# EAGLE design tiny-avionics (EAGLE 7.7.0)
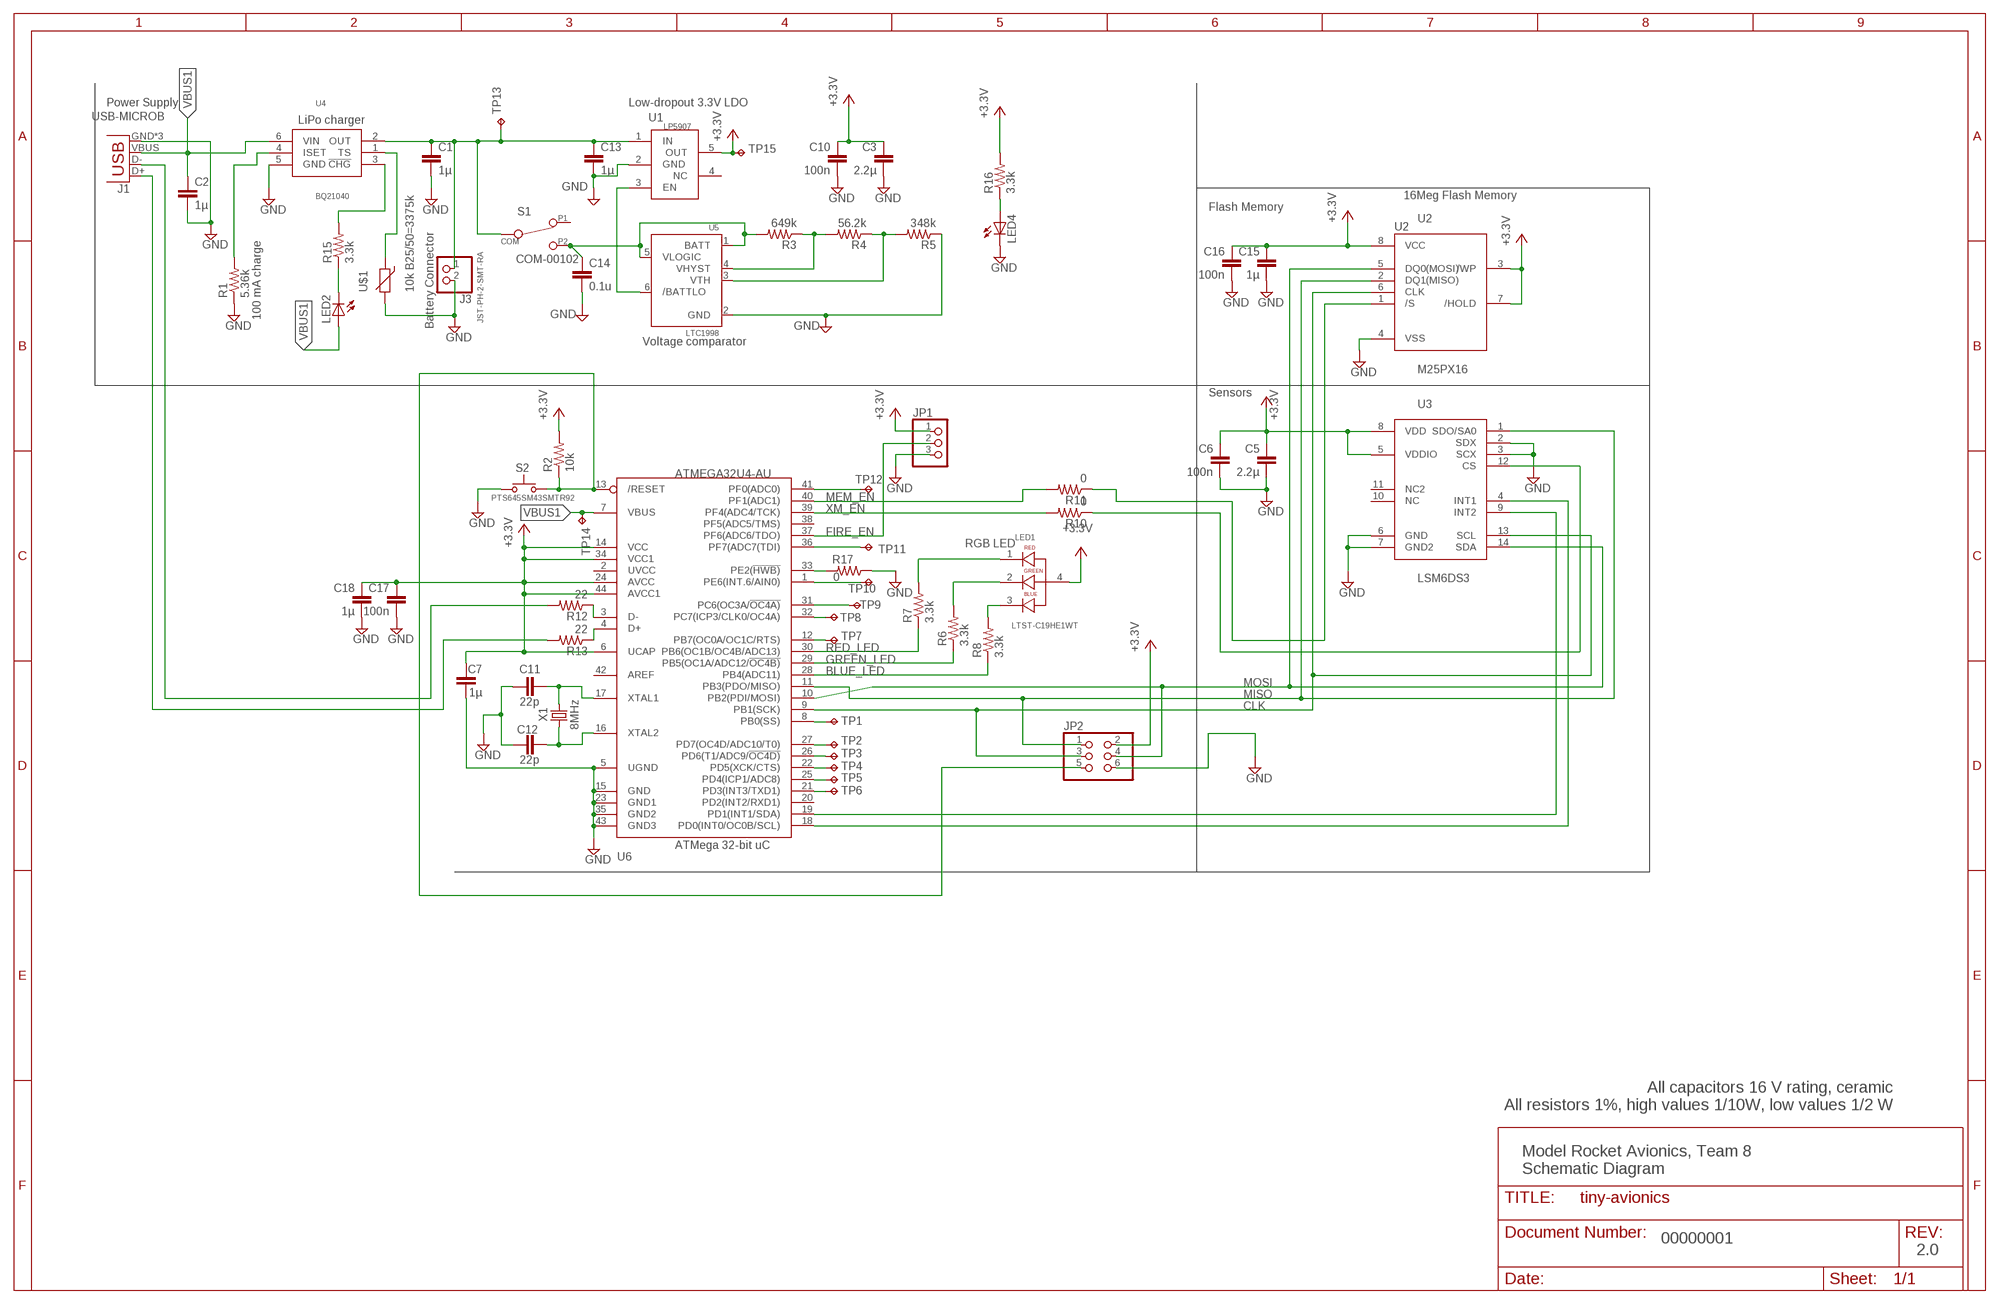
[diagram p0: schematic, sheet 1]

## Parts
C1  1µ  C-EUC0603  [C0603]
C2  1µ  C-EUC0603  [C0603]
C3  2.2µ  C-EUC0603  [C0603]
C5  2.2µ  C-EUC0603  [C0603]
C6  100n  C-EUC0603  [C0603]
C7  1µ  C-EUC0603  [C0603]
C10  100n  C-EUC0603  [C0603]
C11  22p  C-EUC0603  [C0603]
C12  22p  C-EUC0603  [C0603]
C13  1µ  C-EUC0603  [C0603]
C14  0.1u  C-EUC0603  [C0603]
C15  1µ  C-EUC0603  [C0603]
C16  100n  C-EUC0603  [C0603]
C17  100n  C-EUC0603  [C0603]
C18  1µ  C-EUC0603  [C0603]
J1  USB-MICROB  [USB-MICROB]
J3  JST-PH-2-SMT-RA  JST_2PIN-SMT-RA  [JST-PH-2-SMT-RA]
JP1  PINHD-1X3  [1X03]
JP2  PINHD-2X3  [2X03]
LED1  LTST-C19HE1WT  [LEDSC85P160X160X35-4N]
LED2  LEDCHIP-LED0603  [CHIP-LED0603]
LED4  LEDCHIP-LED0603  [CHIP-LED0603]
R1  5.36k  R-US_R0603  [R0603]
R2  10k  R-US_R0603  [R0603]
R3  649k  R-US_R0603  [R0603]
R4  56.2k  R-US_R0603  [R0603]
R5  348k  R-US_R0603  [R0603]
R6  3.3k  R-US_R0603  [R0603]
R7  3.3k  R-US_R0603  [R0603]
R8  3.3k  R-US_R0603  [R0603]
R10  0  R-US_R0603  [R0603]
R11  0  R-US_R0603  [R0603]
R12  22  R-US_R0603  [R0603]
R13  22  R-US_R0603  [R0603]
R15  3.3k  R-US_R0603  [R0603]
R16  3.3k  R-US_R0603  [R0603]
R17  0  R-US_R0603  [R0603]
S1  COM-00102  [ESWITCH]
S2  PTS645SM43SMTR92  PTS645SSMTR  [PTS645-SMD]
TP1  TPTP08R  [TP08R]
TP2  TPTP08R  [TP08R]
TP3  TPTP08R  [TP08R]
TP4  TPTP08R  [TP08R]
TP5  TPTP08R  [TP08R]
TP6  TPTP08R  [TP08R]
TP7  TPTP08R  [TP08R]
TP8  TPTP08R  [TP08R]
TP9  TPTP08R  [TP08R]
TP10  TPTP08R  [TP08R]
TP11  TPTP08R  [TP08R]
TP12  TPTP08R  [TP08R]
TP13  TPTP08R  [TP08R]
TP14  TPTP08R  [TP08R]
TP15  TPTP08R  [TP08R]
U1  LP5907  [SOT23-5L]
U2  M25PX16  [SO8]
U3  LSM6DS3  [LGA-14L]
U4  BQ21040  [SOT23-6L]
U5  LTC1998  [TSOT23-6]
U6  ATMEGA32U4-AU  [TQFP44]
U$1  10k B25/50=3375k  THERMISTOR-SMD0603  [R0603]
X1  8MHz  CRYSTAL-NOGND-SMD  [ATS-SM]

## Nets
BLUE_LED: R8.1 U6.28(PB4(ADC11))
CLK: JP2.3 U2.6(CLK) U3.13(SCL) U6.9(PB1(SCK))
D+: J1.D+ R13.2
D-: J1.D- R12.2
FIRE_EN: JP1.2 U6.37(PF6(ADC6/TDO))
GND: C1.2 C2.2 C3.2 C5.2 C6.2 C7.2 C10.2 C11.2 C12.2 C13.2 C14.2 C15.2 C16.2 C17.2 C18.2 J1.GND J1.MT1(GND) J1.MT2(GND) J3.2 JP1.3 JP2.6 LED4.C R1.1 R5.1 R17.1 S2.1(P) S2.2(P) U1.2(GND) U2.4(VSS) U3.2(SDX) U3.3(SCX) U3.6(GND) U3.7(GND2) U4.5(GND) U5.2(GND) U6.5(UGND) U6.15(GND) U6.23(GND1) U6.35(GND2) U6.43(GND3) U$1.2
GREEN_LED: R6.1 U6.29(PB5(OC1A/ADC12/!OC4B))
MEM_EN: R11.1 U2.1(/S)
MISO: JP2.1 U2.2(DQ1(MISO)) U3.1(SDO/SA0) U6.11(PB3(PDO/MISO))
MOSI: JP2.4 U2.5(DQ0(MOSI)) U3.14(SDA) U6.10(PB2(PDI/MOSI))
N$1: LED1.1 R7.2
N$2: C11.1 U6.17(XTAL1) X1.1
N$3: JP2.5 R2.1 S2.3(S) S2.4(S) U6.13(/RESET)
N$4: R15.2 U4.3(!CHG)
N$5: C12.1 U6.16(XTAL2) X1.2
N$6: R12.1 U6.3(D-)
N$7: LED1.2 R6.2
N$8: LED1.3 R8.2
N$9: U4.1(TS) U$1.1
N$10: U3.4(INT1) U6.18(PD0(INT0/OC0B/SCL))
N$11: U3.9(INT2) U6.19(PD1(INT1/SDA))
N$12: R3.1 R4.2 U5.4(VHYST)
N$13: C1.1 C13.1 J3.1 S1.2(COM) TP13.TP U1.1(IN) U4.2(OUT)
N$14: R4.1 R5.2 U5.3(VTH)
N$15: C14.1 R3.2 S1.3(P2) U5.1(BATT) U5.5(VLOGIC)
N$18: U1.3(EN) U5.6(/BATTLO)
N$21: R10.2 U6.39(PF4(ADC4/TCK))
N$22: R11.2 U6.40(PF1(ADC1))
N$47: R13.1 U6.4(D+)
N$48: LED2.C R15.1
N$49: R1.2 U4.4(ISET)
N$53: LED4.A R16.1
N$65: R17.2 U6.33(PE2(!HWB))
RED_LED: R7.1 U6.30(PB6(OC1B/OC4B/ADC13))
TP1: TP1.TP U6.8(PB0(SS))
TP2: TP2.TP U6.27(PD7(OC4D/ADC10/T0))
TP3: TP3.TP U6.26(PD6(T1/ADC9/!OC4D))
TP4: TP4.TP U6.22(PD5(XCK/CTS))
TP5: TP5.TP U6.25(PD4(ICP1/ADC8))
TP6: TP6.TP U6.21(PD3(INT3/TXD1))
TP7: TP7.TP U6.12(PB7(OC0A/OC1C/RTS))
TP8: TP8.TP U6.32(PC7(ICP3/CLK0/OC4A))
TP9: TP9.TP U6.31(PC6(OC3A/!OC4A))
TP10: TP10.TP U6.1(PE6(INT.6/AIN0))
TP11: TP11.TP U6.36(PF7(ADC7(TDI))
TP12: TP12.TP U6.41(PF0(ADC0))
VBUS1: C2.1 J1.VBUS LED2.A TP14.TP U4.6(VIN) U6.7(VBUS)
VCC: C3.1 C5.1 C6.1 C7.1 C10.1 C15.1 C16.1 C17.1 C18.1 JP1.1 JP2.2 LED1.4 R2.2 R16.2 TP15.TP U1.5(OUT) U2.3(/WP) U2.7(/HOLD) U2.8(VCC) U3.5(VDDIO) U3.8(VDD) U6.6(UCAP) U6.14(VCC) U6.24(AVCC) U6.34(VCC1) U6.44(AVCC1) ; supply symbol labelled +3.3V
XM_EN: R10.1 U3.12(CS)
Unconnected: S1.1 U1.4(NC) U3.10(NC) U3.11(NC2) U6.2(UVCC) U6.20(PD2(INT2/RXD1)) U6.38(PF5(ADC5/TMS)) U6.42(AREF)

## Notes on the sheet
- Power Supply | Low-dropout 3.3V LDO
- LiPo charger | U1
- 16Meg Flash Memory
- Flash Memory
- Battery Connector | U2
- 100 mA charge
- Voltage comparator
- Sensors
- RGB LED
- ATMega 32-bit uC
- All capacitors 16 V rating, ceramic
  All resistors 1%, high values 1/10W, low values 1/2 W
- Model Rocket Avionics, Team 8
  Schematic Diagram
- 00000001
- 2.0

## Library data of the parts
C1-C3 C5-C7 C10-C18 = rcl:C-EU: CAPACITOR, European symbol
J1 = SparkFun-Connectors:USB: USB Connectors USB-B-PTH is fully proven SKU : PRT-00139/CONN-08278 USB-miniB is fully proven SKU : PRT-00587 USB-A-PCB is untested. USB-A-H is throughly reviewed, but untested. Spark Fun Electronics SKU : PRT-00437 USB-B-SMT is throughly reviewed, but untested. Needs silkscreen touching up. USB-A-S has not been used/tested USB-MB-H has not been used/tested USB-MICROB has been used. CONN-09505; PROD_ID: CONN-09505
J3 = adafruit:JST_2PIN: JST 2-Pin Connectors of various flavors SMT-RA (S2B-PH-SM4) 4UConnector #17311 SMT (B2B-PH-SM4) THM-RA (S2B-PH) THM (B2B-PH)
JP1 = pinhead:PINHD-1X3: PIN HEADER
JP2 = pinhead:PINHD-2X3: PIN HEADER
LED1 = LTST-C19HE1WT:LTST-C19HE1WT: R/G/B 0606 Flat Top Rectangle 130° 112.5/281/104 mcd Diffused Chip LED; AVAILABILITY: Good; DESCRIPTION: R/G/B 0606 Flat Top Rectangle 130° 112.5/281/104 mcd Diffused Chip LED; MF: Lite-On; MP: LTST-C19HE1WT; PACKAGE: None; PRICE: 0.59 USD; VENDOR: DIGIKEY; VENDOR_PN: 160-2162-1-ND
LED2 LED4 = adafruit:LED: LED OSRAM: - CHIPLED LG R971, LG N971, LY N971, LG Q971, LY Q971, LO R971, LY R971 LH N974, LH R974 LS Q976, LO Q976, LY Q976 LO Q996 - Hyper CHIPLED LW Q18S LB Q993, LB Q99A, LB R99A - SideLED LS A670, LO A670, LY A670, LG A670, LP A670 LB A673, LV A673, LT A673, LW A673 LH A674 LY A675 LS A676, LA A676, LO A676, LY A676, LW A676 LS A679, LY A679, LG A679 - Hyper Micro SIDELED® LS Y876, LA Y876, LO Y876, LY Y876 LT Y87S - SmartLED LW L88C, LW L88S LB L89C, LB L89S, LG L890 LS L89K, LO L89K, LY L89K LS L896, LA L896, LO L896, LY L896 - TOPLED LS T670, LO T670, LY T670, LG T670, LP T670 LSG T670, LSP T670, LSY T670, LOP T670, LYG T670 LG T671, LOG T671, LSG T671 LB T673, LV T673, LT T673, LW T673 LH T674 LS T676, LA T676, LO T676, LY T676, LB T676, LH T676, LSB T676, LW T676 LB T67C, LV T67C, LT T67C, LS T67K, LO T67K, LY T67K, LW E67C LS E67B, LA E67B, LO E67B, LY E67B, LB E67C, LV E67C, LT E67C LW T67C LS T679, LY T679, LG T679 LS T770, LO T770, LY T770, LG T770, LP T770 LB T773, LV T773, LT T773, LW T773 LH T774 LS E675, LA E675, LY E675, LS T675 LS T776, LA T776, LO T776, LY T776, LB T776 LHGB T686 LT T68C, LB T68C - Hyper Mini TOPLED® LB M676 - Mini TOPLED Santana® LG M470 LS M47K, LO M47K, LY M47K Source: http://www.osram.convergy.de/
R1-R8 R10-R13 R15-R17 = rcl:R-US_: RESISTOR, American symbol
S1 = tinyav-lib:COM-00102: Small SPDT switch listed on SparkFun as COM-00102. Equivalent to E-Switch EG1218.
S2 = switch-ck:PTS645S???SMTR: TACT SWITCH; MPN: PTS645SM43SMTR92 LFS; VENDOR: DIGIKEY; VENDOR_PN: CKN9112CT-ND
TP1-TP15 = testpad:TP: Test pad
U1 = adafruit:LP5907
U2 = tinyav-lib:M25PX16: 8-pin SPI Flash Memory
U3 = tinyav-lib:LSM6DS3
U4 = tinyav-lib:BQ21040: Lithium-ion battery charger. VIN: 3.5V - 28V
U5 = tinyav-lib:LTC1998
U6 = adafruit:ATMEGA32U4: http://www.ladyada.net/library/eagle
U$1 = tinyav-lib:THERMISTOR-SMD
X1 = tinyav-lib:CRYSTAL-NOGND-SMD: "A surface-mount implementation of the 8-MHz crystal"; MPN: ATS080B; VENDOR: DIGIKEY; VENDOR_PN: CTX900-ND

## Board
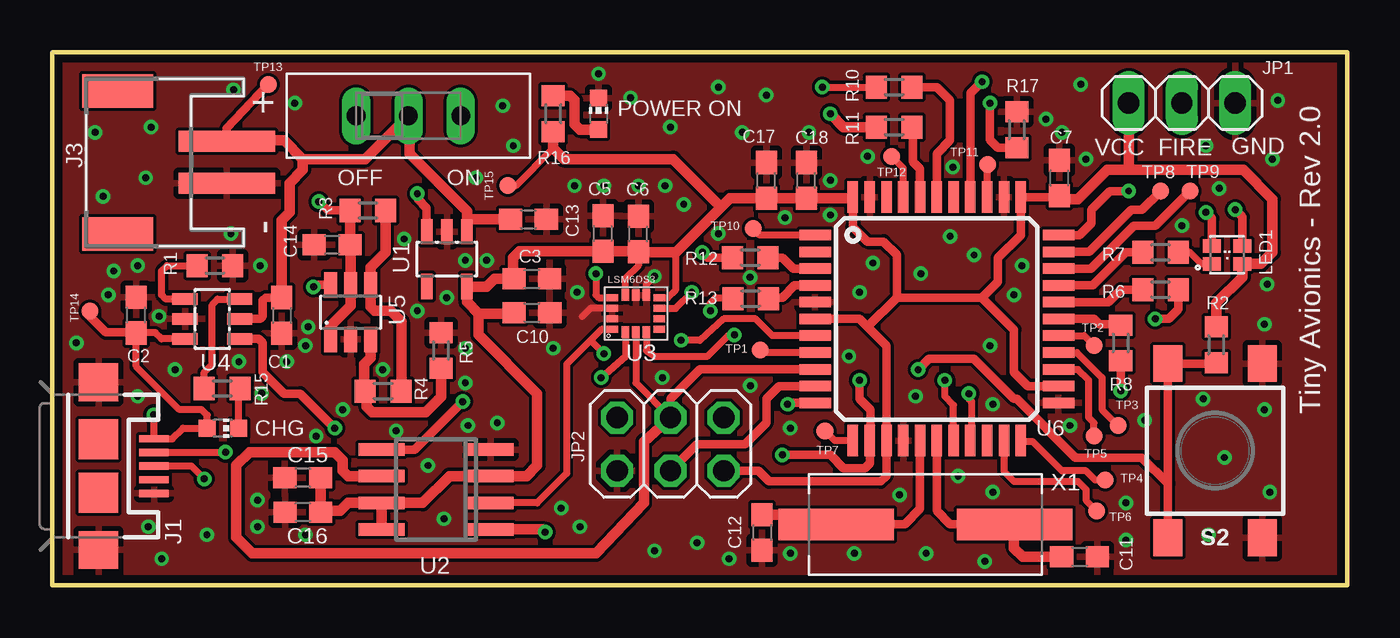
[diagram p1: board, top side]
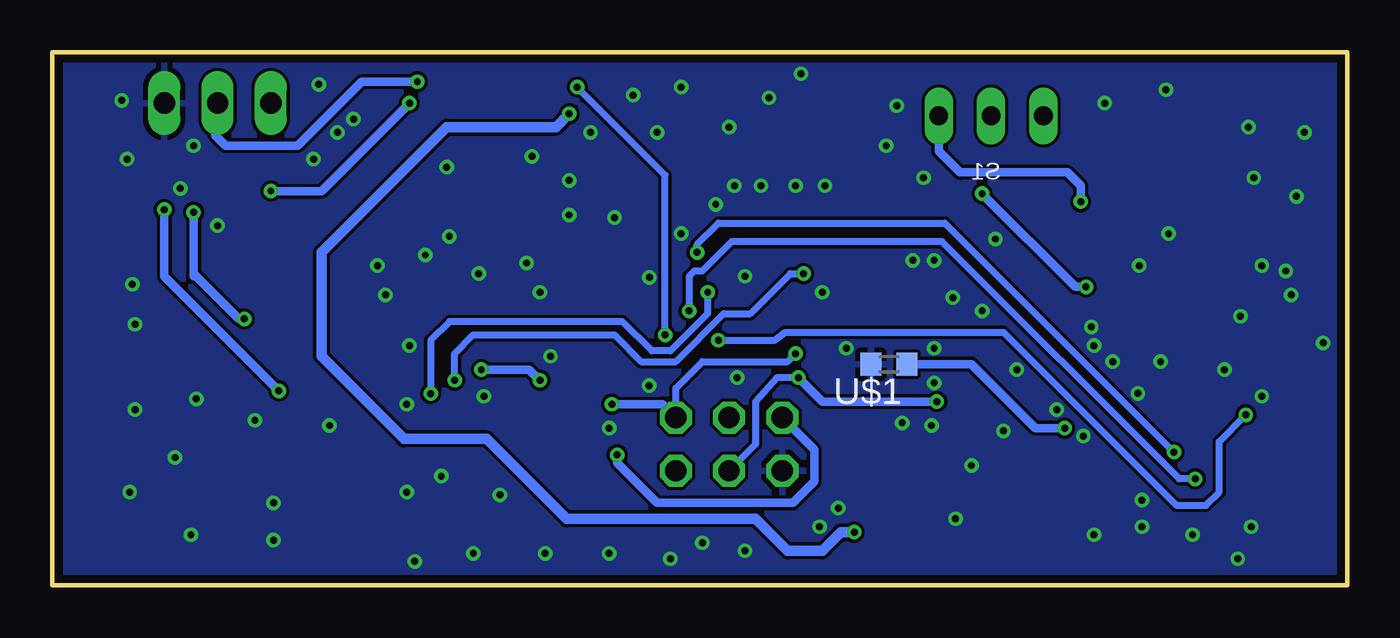
[diagram p2: board, bottom side, seen from below]

Size 61.72 x 25.4 mm. Coordinates in mm from the lower left corner, seen from the top.
Outline: 0,25.4 0,0 61.72,0 61.72,25.4 0,25.4
Copper layers (1*16): Top 0.0356mm / dielectric 1.5011mm / Bottom 0.0356mm
Design rules "LaenPCBOrder *": minimum track width 6mil, minimum drill 13mil, track to track 6mil, track to pad 6mil, pad to pad 6mil, via to via 6mil, smd to smd 6mil, copper to edge 15mil, drill to drill 6mil, minimum pad ring 7mil, minimum via ring 7mil, stop-mask expansion 3mil, vias tented up to drill 15mil, thermal gap 10mil

### Footprints (pad centres in the part's own frame; a part is rotated, then mirrored left to right if it is on the bottom)
C0603 = smd 1.1 x 1: 1 -0.85,0; 2 0.85,0
USB-MICROB = smd 0.35 x 1.4: D+ 0,2.65; D- -0.65,2.65; GND 1.3,2.65; ID 0.65,2.65; VBUS -1.3,2.65 | smd 1.8 x 1.9: MT1 -4,0; MT2 4,0 | smd 1.9 x 1.9: P$1 -1.27,0; P$2 1.27,0
JST-PH-2-SMT-RA = smd 1 x 4.6: 1 1,-3.7; 2 -1,-3.7 | smd 1.6 x 3.4: NC1 -3.4,1.5; NC2 3.4,1.5
1X03 = drill 1.016 long: 1 -2.54,0; 2 0,0; 3 2.54,0
2X03 = drill 1.016 octagon: 1 -2.54,-1.27; 2 -2.54,1.27; 3 0,-1.27; 4 0,1.27; 5 2.54,-1.27; 6 2.54,1.27
LEDSC85P160X160X35-4N = smd 0.65 x 0.85: 1 -0.425,0.725; 2 0.425,0.725; 3 0.425,-0.725; 4 -0.425,-0.725
CHIP-LED0603 = smd 0.8 x 0.8: A 0,-0.75; C 0,0.75
R0603 = smd 1 x 1.1: 1 -0.85,0; 2 0.85,0
ESWITCH = drill 0.9 pad 1.2 long: 1 -2.5,0; 2 0,0; 3 2.5,0
PTS645-SMD = smd 1.75 x 1.4: 1 -4.15,2.25; 2 4.15,2.25; 3 -4.15,-2.25; 4 4.15,-2.25
TP08R = smd 0.8 x 0.8: TP 0,0
SOT23-5L = smd 0.55 x 1.2: 1 -0.95,-1.3; 2 0,-1.3; 3 0.95,-1.3; 4 0.95,1.3; 5 -0.95,1.3
SO8 = smd 0.6 x 2.2: 1 -1.905,-2.6; 2 -0.635,-2.6; 3 0.635,-2.6; 4 1.905,-2.6; 5 1.905,2.6; 6 0.635,2.6; 7 -0.635,2.6; 8 -1.905,2.6
LGA-14L = smd 0.55 x 0.34: 1 1.13,0.75; 2 1.13,0.25; 3 1.13,-0.25; 4 1.13,-0.75; 8 -1.12,-0.75; 9 -1.12,-0.25; 10 -1.12,0.25; 11 -1.12,0.75 | smd 0.34 x 0.55: 5 0.5,-0.88; 6 0,-0.88; 7 -0.5,-0.88; 12 -0.5,0.88; 13 0,0.88; 14 0.5,0.88
SOT23-6L = smd 0.55 x 1.2: 1 -0.95,-1.3; 2 0,-1.3; 3 0.95,-1.3; 4 0.95,1.3; 5 0,1.3; 6 -0.95,1.3
TSOT23-6 = smd 0.62 x 1.22: 1 -0.95,-1.3; 2 0,-1.3; 3 0.95,-1.3; 4 0.95,1.3; 5 0,1.3; 6 -0.95,1.3
TQFP44 = smd 1.5 x 0.5: 1 -5.8,4; 2 -5.8,3.2; 3 -5.8,2.4; 4 -5.8,1.6; 5 -5.8,0.8; 6 -5.8,0; 7 -5.8,-0.8; 8 -5.8,-1.6; 9 -5.8,-2.4; 10 -5.8,-3.2; 11 -5.8,-4; 23 5.8,-4; 24 5.8,-3.2; 25 5.8,-2.4; 26 5.8,-1.6; 27 5.8,-0.8; 28 5.8,0; 29 5.8,0.8; 30 5.8,1.6; 31 5.8,2.4; 32 5.8,3.2; 33 5.8,4 | smd 0.5 x 1.5: 12 -4,-5.8; 13 -3.2,-5.8; 14 -2.4,-5.8; 15 -1.6,-5.8; 16 -0.8,-5.8; 17 0,-5.8; 18 0.8,-5.8; 19 1.6,-5.8; 20 2.4,-5.8; 21 3.2,-5.8; 22 4,-5.8; 34 4,5.8; 35 3.2,5.8; 36 2.4,5.8; 37 1.6,5.8; 38 0.8,5.8; 39 0,5.8; 40 -0.8,5.8; 41 -1.6,5.8; 42 -2.4,5.8; 43 -3.2,5.8; 44 -4,5.8
ATS-SM = smd 5.5 x 1.5: 1 4.25,0; 2 -4.25,0

### Placement (x,y rotation side)
C1  10.93,12.87 270 top
C2  4,12.88 90 top
C3  22.86,14.61 0 top
C5  26.25,16.77 90 top
C6  27.93,16.75 90 top
C7  48.02,19.41 90 top
C10  22.86,13 0 top
C11  48.96,1.37 0 top
C12  33.83,2.52 270 top
C13  22.7,17.44 0 top
C14  13.34,16.23 180 top
C15  11.93,5.13 180 top
C16  11.94,3.49 180 top
C17  34.04,19.3 90 top
C18  35.94,19.3 90 top
J1  2.2,5.69 270 top
J3  4.61,20.16 90 top
JP1  53.85,22.99 0 top
JP2  29.46,6.73 180 top
LED1  56.01,15.75 90 top
LED2  8.13,7.49 270 top
LED4  26.04,22.48 0 top
R1  7.75,15.24 180 top
R2  55.48,11.47 90 top
R3  15.04,17.87 180 top
R4  15.77,9.26 0 top
R5  18.52,11.2 270 top
R6  52.83,14.1 0 top
R7  52.83,15.88 0 top
R8  50.93,11.56 270 top
R10  40.13,23.75 0 top
R11  40.13,21.84 0 top
R12  33.27,15.62 180 top
R13  33.29,13.66 180 top
R15  8.09,9.38 180 top
R16  23.88,22.48 270 top
R17  45.97,21.72 270 top
S1  16.97,22.38 0 top
S2  55.43,6.42 270 top
TP1  33.73,11.22 0 top
TP2  49.66,11.43 0 top
TP3  50.8,7.62 0 top
TP4  50.19,5.02 0 top
TP5  49.66,7.11 0 top
TP6  49.78,3.56 0 top
TP7  36.83,7.37 0 top
TP8  52.83,18.8 0 top
TP9  54.23,18.8 0 top
TP10  33.4,17.02 0 top
TP11  44.58,20.07 0 top
TP12  40.01,20.45 0 top
TP13  10.29,23.88 0 top
TP14  1.78,13.08 0 top
TP15  21.72,19.05 0 top
U1  18.81,15.55 180 top
U2  18.29,4.57 90 top
U3  27.81,12.95 180 top
U4  7.62,12.7 90 top
U5  14.22,13.02 0 top
U6  42.16,12.7 0 top
U$1  21.84,10.54 180 bottom
X1  41.63,2.9 0 top

### Tracks (layer width: path | path; a pad name or v marks a point on that pad's centre or on a via)
BLUE_LED
  Top 0.406: U6.28 49.66,12.7 49.91,12.45 50.89,12.45 R8.1
CLK
  Top 0.33: U3.13 27.81,9.65 JP2.3
  Top 0.406: U6.9 30.87,10.3 29.46,8.89 JP2.3
  Top 0.508: U2.6 14.1,5.21 13.84,5.46 13.84,5.97 13.46,6.35 9.4,6.35 8.76,5.71 8.76,2.29 9.53,1.52 25.91,1.52 28.19,3.94 28.19,6.86 JP2.3
D+  (via drill 0.33)
  Top 0.33: v7.24,5.08 6.63,5.69 J1.D+ | v31.37,13.08 31.37,13.46 31.62,13.72 32.38,13.72 R13.2
  Bottom 0.33: v7.24,5.08 8,5.08 19.3,16.38 29.34,16.38 30.73,14.99 31.11,14.99 31.37,14.73 v31.37,13.08
D-  (via drill 0.33)
  Top 0.33: J1.D- 8.24,6.34 v8.26,6.35
  Top 0.406: R12.2 31.24,15.62 v30.99,15.88
  Bottom 0.33: v30.99,15.88 30.99,16.26 29.97,17.27 19.18,17.27 v8.26,6.35
FIRE_EN  (via drill 0.33)
  Top 0.406: U6.37 43.76,23.44 v44.32,24
  Bottom 0.406: v44.32,24 46.99,24 50.04,20.95 53.47,20.95 53.98,21.46 53.98,22.86 JP1.2
GND  (via drill 0.33, 0.33 pad 0.69)
  Top 0.33: U3.7 28.31,14.34 v28.7,14.73 | U3.3 25.65,13.2 25.27,12.83
  other vias: 7.37,2.41 9.78,4.06 9.78,2.79 12.06,2.41 5.84,10.29 8.89,10.67 12.19,12.32 9.91,15.24 8.51,16.76 4.06,15.24 2.92,14.99 2.67,13.84 4.45,19.43 2.03,21.59 11.56,22.99 27.56,23.24 26.04,24.38 32.89,21.59 36.07,21.59 37.08,19.3 38.86,20.45 42.93,19.94 42.8,16.64 43.94,15.75 46.23,15.24 45.85,13.84 44.7,11.43 41.15,9.02 44.83,8.64 37.97,10.92 44.45,1.14 41.66,1.52 55.12,2.41 51.18,3.94 52.07,7.87 57.78,8.38 55.88,6.1 54.86,8.89 57.78,12.45 57.91,14.35 55.63,18.92 53.85,17.14 54.99,20.95 58.17,20.32 58.42,23.11 48.13,21.59 47.37,22.23 49.28,20.32 49.02,23.88 29.21,19.05 27.94,19.05 26.29,19.05 24.89,19.05 25.02,13.97 23.88,11.3 19.68,9.65 19.68,11.3 18.8,13.72 20.7,15.49 19.68,15.49 20.19,19.43 21.97,20.95 21.46,22.86 29.46,21.84 31.75,23.75 34.04,23.37 39.12,15.37 38.48,13.97 37.08,17.65 34.92,17.53 41.4,14.86 43.18,5.21 40.39,4.32 13.84,8.38 17.91,5.71 18.67,3.17 5.21,1.27 1.14,11.56 58.04,4.45 24.26,3.68 21.21,7.75 17.4,13.08 15.75,10.29 5.08,12.83 11.18,10.67 12.06,11.43 16.38,7.37 19.81,7.62 4.57,2.79 33.26,14.68 31.75,16.76 16.76,16.51 30.1,18.16 2.41,18.54 8.64,23.62 4.06,9.02 48.51,7.62 12.57,7.11 9.97,9.15 35.18,1.52 32.26,1.27 38.23,1.52 4.7,21.84 44.83,4.45 51.18,2.16 29.08,9.91 30.73,2.03 28.7,1.65 25.15,2.79 35.18,7.49 33.27,9.53
  pour Bottom (rank 2): 0,25.4 61.09,25.4 61.09,0 0,0
  pour Top (rank 2): 0,25.4 61.09,25.4 61.09,0 0,0
GREEN_LED
  Top 0.406: U6.29 50.33,13.5 50.93,14.1 R6.1
MEM_EN  (via drill 0.33)
  Top 0.508: U2.1 23.37,2.67 v23.5,2.54 | v37.08,22.48 37.72,21.84 R11.1
  Bottom 0.508: v23.5,2.54 24.13,2.54 25.02,1.65 26.67,1.65 28.19,3.17 37.21,3.17 41.02,6.99 44.96,6.99 48.9,10.92 48.9,15.88 42.93,21.84 37.72,21.84 v37.08,22.48
MISO  (via drill 0.33)
  Top 0.33: U3.1 26.17,12.2 25.65,11.68 | 25.65,11.68 24.51,10.54 24.51,5.33 23.11,3.94 U2.2 | v26.29,11.05 25.65,11.68
  Top 0.406: U6.11 35.12,8.7 v35.05,8.64
  Bottom 0.33: JP2.1 32,9.4 30.73,10.67 26.67,10.67 v26.29,11.05
  Bottom 0.406: v35.05,8.64 32.64,8.64 JP2.1
MOSI  (via drill 0.33)
  Top 0.33: U3.14 27.31,10.93 v26.16,9.91
  Top 0.406: U2.5 17.27,6.48 v19.56,8.76 | U6.10 34.65,9.5 34.04,8.89 34.04,7.75 33.02,6.73 30.73,6.73 JP2.4
  Bottom 0.33: v26.16,9.91 27.18,9.91 28.19,8.76 28.19,6.73 JP2.4
  Bottom 0.406: v19.56,8.76 25.02,8.76 v26.16,9.91
N$1
  Top 0.33: LED1.1 54.78,15.32 54.23,15.88 R7.2
N$2
  Top 0.406: U6.17 42.16,3.56 42.8,2.92 45.34,2.92 | 45.34,2.92 45.85,2.92 X1.1 | 45.88,2.38 45.34,2.92
  Top 0.508: C11.1 46.26,1.37 45.85,1.78 45.85,2.35 45.88,2.38
N$3  (via drill 0.33)
  Top 0.406: v34.8,6.22 37.08,6.22 37.72,5.59 38.73,5.59 38.96,5.82 U6.13 38.99,6.92 38.99,8.38 38.48,8.89 v38.48,9.78 | v41.27,10.29 41.78,10.79 43.94,10.79 45.85,8.89 45.97,8.89 48.77,6.1 51.94,6.1 53.18,4.86 S2.4 S2.3 55.48,10.57 R2.1
  Bottom 0.406: v41.27,10.29 38.99,10.29 v38.48,9.78 | v34.8,6.22 34.8,5.84 32.89,3.94 26.42,3.94 25.4,4.95 25.4,6.48 JP2.5
N$4
  Top 0.33: R15.2 7.24,10.16 7.62,10.54 7.62,13.39 7.87,13.64 U4.3
N$5
  Top 0.406: U6.16 41.36,3.65 40.64,2.92 37.4,2.92 X1.2 37.22,2.75
  Top 0.508: C12.1 35.23,3.37 35.43,3.17 37.1,3.17 X1.2
N$6
  Top 0.406: U6.3 35.32,15.1 34.8,15.62 R12.1
N$7  (via drill 0.33)
  Top 0.406: LED1.2 55.28,17.49 v54.99,17.78 | R6.2 53.68,13.17 53.21,12.7 v52.58,12.7
  Bottom 0.406: v54.99,17.78 54.99,14.86 | 54.99,14.86 54.99,14.73 | v52.58,12.7 52.83,12.7 54.99,14.86
N$8  (via drill 0.33)
  Top 0.406: LED1.3 56.73,17.56 v56.39,17.91 | v50.93,9.27 R8.2
  Bottom 0.406: v56.39,17.91 56.39,14.73 v50.93,9.27
N$9  (via drill 0.33 pad 0.69)
  Top 0.406: U4.1 9.84,11.75 10.03,11.56 10.03,10.16 11.05,9.14 11.81,9.14 v13.46,7.49
  Bottom 0.406: v13.46,7.49 14.86,7.49 17.91,10.54 U$1.1
N$10  (via drill 0.33)
  Top 0.33: U6.18 42.96,8.6 42.55,9.02 v42.55,9.78 | v25.91,14.86 25.91,13.84 26.04,13.72 26.67,13.72 U3.4
  Bottom 0.33: v42.55,9.78 42.55,11.05 41.66,11.94 34.92,11.94 33.66,10.67 32,10.67 29.72,12.95 28.45,12.95 26.54,14.86 v25.91,14.86
N$11  (via drill 0.33)
  Top 0.33: U3.9 29.71,13.2 v30.48,13.97 | v43.69,9.14 43.69,8.89 43.81,8.76 43.81,6.95 U6.19
  Bottom 0.33: v30.48,13.97 30.48,12.95 32.26,11.18 33.15,11.18 34.54,12.57 42.8,12.57 43.69,11.68 v43.69,9.14
N$12
  Top 0.508: R3.1 15.88,17.85 15.88,15.88 15.17,15.17 U5.4 15.17,13.28 15.37,13.08 16.13,13.08 16.64,12.57 16.64,9.4 R4.2
N$13
  Top 0.406: U4.2 9.91,12.7 10.03,12.83 10.03,13.59 10.16,13.72 C1.1 | J3.1 8.31,21.79 TP13.TP
  Top 0.508: 11.94,20.32 14.91,20.32 S1.2 17.02,22.33 17.02,20.57 19.76,17.84 19.76,17.4 | 11.94,20.32 11.94,19.81 11.3,19.18 11.3,17.78 10.92,17.4 10.92,13.73 C1.1 | U1.1 19.76,17.4 | C13.1 19.8,17.44 19.76,17.4 | 11.94,20.32 11.05,21.21 8.36,21.21 J3.1
N$14
  Top 0.508: U5.3 15.17,10.85 14.86,10.54 14.86,9.44 R4.1 14.99,9.32 14.99,8.51 15.24,8.26 17.78,8.26 18.52,9 R5.2
N$15  (via drill 0.33)
  Top 0.406: R3.2 13.12,17.87 v12.7,18.29
  Top 0.508: R3.2 C14.1 14.22,16.2 U5.5 14.22,13.34 13.27,12.38 U5.1
  Bottom 0.406: v12.7,18.29 12.7,19.05 13.34,19.68 18.46,19.68 19.47,20.69 S1.3
N$18  (via drill 0.33)
  Top 0.406: U5.6 12.54,14.32 v12.45,14.22 | v17.4,18.67 17.4,18.42 17.85,17.97 17.85,16.86 U1.3
  Bottom 0.406: v12.45,14.22 12.95,14.22 v17.4,18.67
N$21
  Top 0.406: U6.39 42.16,20.57 42.8,21.21 42.8,23.11 42.16,23.75 R10.2
N$22
  Top 0.406: U6.40 41.36,19.85 41.02,20.19 41.02,21.8 R11.2
N$47
  Top 0.406: U6.4 35.38,14.3 34.8,13.72 33.94,13.72 R13.1
N$48
  Top 0.33: LED2.C 8.88,9.32 R15.1
N$49
  Top 0.33: U4.4 5.4,13.65 5.21,13.84 5.21,14.99 5.46,15.24 R1.2
N$53
  Top 0.508: R16.1 24.68,23.33 24.89,23.11 24.89,21.97 25.15,21.72 26.02,21.72 LED4.A
N$65  (via drill 0.33)
  Top 0.406: U6.33 48.96,16.7 49.53,17.27 49.53,17.91 50.42,18.8 v51.31,18.8 | v44.7,22.99 44.7,21.24 45.07,20.87 R17.2
  Bottom 0.406: v51.31,18.8 48.9,18.8 v44.7,22.99
RED_LED
  Top 0.406: U6.30 49.61,14.3 51.18,15.88 R7.1
TP1
  Top 0.33: U6.8 33.85,11.1 TP1.TP
TP2
  Top 0.33: U6.27 49.19,11.9 TP2.TP
TP3
  Top 0.33: U6.26 48.84,11.1 50.04,9.91 50.04,8.38 TP3.TP
TP4
  Top 0.33: TP4.TP 49.72,5.02 49.28,5.46 48.13,5.46 46.74,6.86 46.21,6.86 U6.22
TP5
  Top 0.33: TP5.TP 49.66,7.75 49.4,8 49.4,9.78 48.9,10.29 47.98,10.29 U6.25
TP6
  Top 0.33: U6.21 45.36,5.44 45.85,4.95 48.9,4.95 49.28,4.57 49.28,4.06 TP6.TP
TP7
  Top 0.33: U6.12 37.3,6.9 TP7.TP
TP8
  Top 0.406: U6.32 49.43,15.9 51.44,17.91 51.94,17.91 TP8.TP
TP9
  Top 0.406: U6.31 49.52,15.1 51.56,17.14 52.58,17.14 TP9.TP
TP10
  Top 0.33: U6.1 33.72,16.7 TP10.TP
TP11
  Top 0.33: U6.36 44.56,20.05 TP11.TP
TP12
  Top 0.33: U6.41 40.56,19.89 TP12.TP
VBUS1  (via drill 0.33)
  Top 0.33: U4.6 5.2,11.75 4.9,12.04 4.01,12.04 C2.1 4,10.42 6.04,8.38 7.11,8.38 7.38,8.12 LED2.A 6.22,7.49 5.72,6.99 J1.VBUS 4.83,7.01 v4.83,8.13 | U6.7 34.33,11.9 33.53,12.7 32,12.7 30.86,11.68 v29.97,11.68
  Top 0.406: TP14.TP 1.78,12.83 2.54,12.06 3.96,12.06 C2.1
  Bottom 0.33: v29.97,11.68 27.3,11.68 26.8,12.06 16.38,12.06 8.13,3.81 6.73,3.81 6.1,4.45 6.1,6.86 v4.83,8.13
VCC
  Top 0.33: C6.1 27.93,15.23 27.3,14.61 27.3,13.84 U3.5 | U3.8 29.32,13.7 29.72,14.1 29.72,15.88 | TP15.TP 22.1,19.05 23.88,20.83
  Top 0.406: 38.12,18.45 U6.44 38.16,17.08 38.86,16.38 39.62,16.38 40.26,15.75 40.26,13.72 | U6.6 38.48,12.7 38.86,12.32 | 38.86,12.32 39.75,11.43 39.75,6.91 | C7.1 47.95,18.5 U6.34 46.16,16.7 45.09,15.62 45.09,14.48 44.32,13.72 | U6.24 46.51,9.5 45.85,10.16 45.85,12.19 44.32,13.72 | 44.32,13.72 40.26,13.72 | 40.26,13.72 38.86,12.32 | 39.75,6.91 U6.14 | 39.75,6.91 39.75,5.21 39.5,4.95 34.16,4.95 33.66,5.46 JP2.2
  Top 0.508: 20.32,12.95 19.76,13.52 U1.5 19.78,14.22 20.7,14.22 21.08,14.61 C3.1 21.97,14.64 21.97,15.62 22.27,15.92 C5.1 27.91,15.92 C6.1 27.96,15.88 29.72,15.88 31.88,18.03 | 20.32,12.95 21.97,12.95 C10.1 | 20.32,12.95 20.32,11.94 23.11,9.14 23.11,5.71 22.61,5.21 U2.3 18.92,5.21 17.65,3.94 U2.7 | U2.7 U2.8 | 31.88,18.03 32.3,18.45 C17.1 C18.1 38.12,18.45 | C7.1 48.02,18.53 48.13,18.41 48.9,18.41 50.29,19.81 51.31,19.81 | R16.2 23.88,20.83 24.38,20.32 29.59,20.32 31.88,18.03 | JP1.1 51.31,19.81 | R2.2 55.5,12.46 55.5,13.46 56.73,14.7 LED1.4 57.61,15.32 58.17,15.88 58.17,18.41 56.77,19.81 51.31,19.81 | U2.7 14.1,3.94 13.72,3.56 12.85,3.56 C16.1 C15.1
XM_EN  (via drill 0.33)
  Top 0.33: U3.12 28.31,11.18 28.7,10.92 31.24,10.92 32.26,11.94 v32.51,11.94 | v36.7,23.75 R10.1
  Bottom 0.33: v32.51,11.94 32.51,19.56 v36.7,23.75

### Text on the board
tPlace: Tiny Avionics - Rev 2.0 | POWER ON | GND | VCC | FIRE | OFF | ON | CHG
Notes: Tiny AV Board Layout / Rev: 1.0 / Date: 12/08/2016 / Team 08